# EAGLE schematic Buildplate_v1.0 (EAGLE 9.6.2)
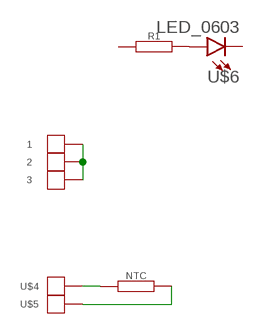
[diagram p0: schematic, sheet 1]

## Parts
1  PAD_POGOPIN_1.3MM  [PAD_POGOPIN_1.3MM]
2  PAD_POGOPIN_1.3MM  [PAD_POGOPIN_1.3MM]
3  PAD_POGOPIN_1.3MM  [PAD_POGOPIN_1.3MM]
NTC  RESISTOR0603-RES  [0603-RES]
R1  RESISTOR0603-RES  [0603-RES]
U$4  PAD_50X100MIL  [PAD_50X100MIL]
U$5  PAD_50X100MIL  [PAD_50X100MIL]
U$6  LED_0603  [0603]

## Nets
N$1: R1.2 U$6.A
N$2: NTC.1 U$4.P$1
N$3: NTC.2 U$5.P$1
N$4: 1.P$1 2.P$1 3.P$1
Unconnected: R1.1 U$6.C

## Library data of the parts
1-3 U$4 U$5 = 0000_GV_connectors:PAD
NTC R1 = 0000_GV_resistors:RESISTOR: Resistor Basic schematic elements and footprints for 0603, 1206, and PTH 1/10th watt (small) resistors.
U$6 = 0000_GV_Leds:LED